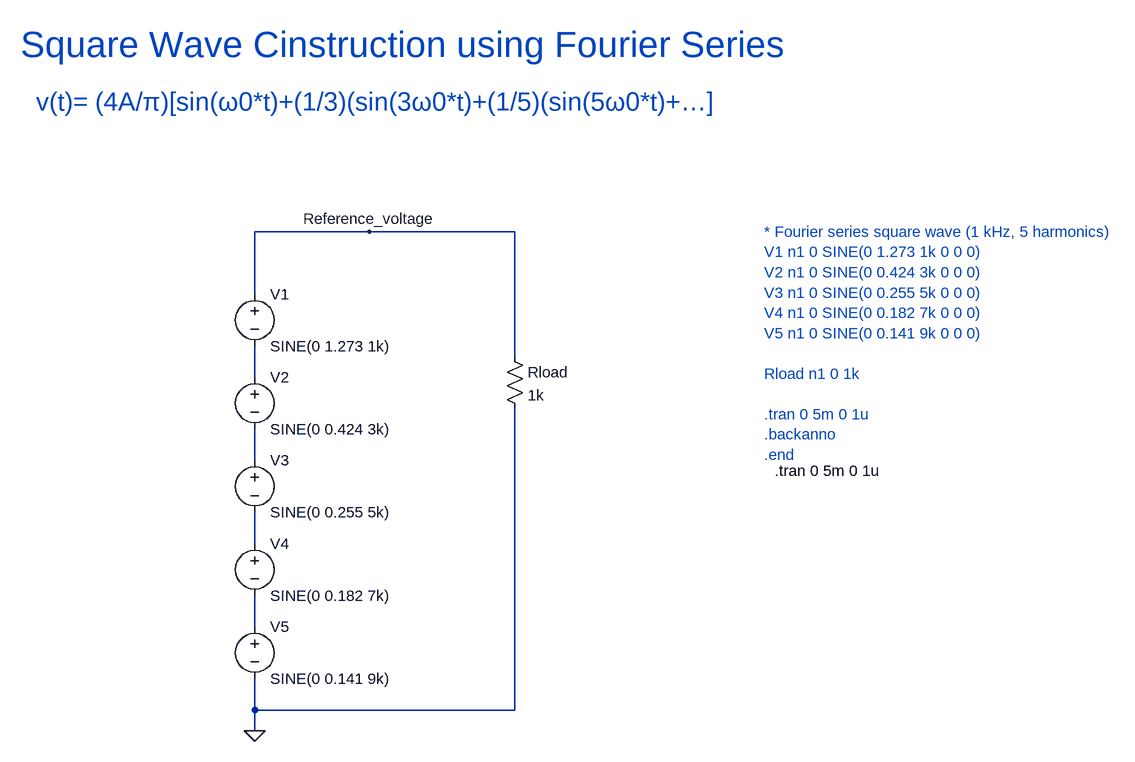
[diagram p0: schematic Sqaure_wave_gen_fourier_series.asc]
Sqaure_wave_gen_fourier_series.asc, the LTspice schematic file:
Version 4
SHEET 1 2504 884
WIRE 864 96 688 96
WIRE 1088 96 864 96
WIRE 688 192 688 96
WIRE 1088 288 1088 96
WIRE 688 320 688 272
WIRE 688 448 688 400
WIRE 688 576 688 528
WIRE 688 704 688 656
WIRE 688 832 688 784
WIRE 1088 832 1088 368
WIRE 1088 832 688 832
WIRE 688 864 688 832
FLAG 688 864 0
FLAG 864 96 Reference_voltage
SYMBOL voltage 688 176 R0
WINDOW 123 0 0 Left 0
WINDOW 39 0 0 Left 0
SYMATTR InstName V1
SYMATTR Value SINE(0 1.273 1k)
SYMBOL voltage 688 304 R0
WINDOW 123 0 0 Left 0
WINDOW 39 0 0 Left 0
SYMATTR InstName V2
SYMATTR Value SINE(0 0.424 3k)
SYMBOL voltage 688 432 R0
WINDOW 123 0 0 Left 0
WINDOW 39 0 0 Left 0
SYMATTR InstName V3
SYMATTR Value SINE(0 0.255 5k)
SYMBOL voltage 688 560 R0
WINDOW 123 0 0 Left 0
WINDOW 39 0 0 Left 0
SYMATTR InstName V4
SYMATTR Value SINE(0 0.182 7k)
SYMBOL voltage 688 688 R0
WINDOW 123 0 0 Left 0
WINDOW 39 0 0 Left 0
SYMATTR InstName V5
SYMATTR Value SINE(0 0.141 9k)
SYMBOL res 1072 272 R0
SYMATTR InstName Rload
SYMATTR Value 1k
TEXT 1472 96 Left 2 ;* Fourier series square wave (1 kHz, 5 harmonics)\nV1 n1 0 SINE(0 1.273 1k 0 0 0)\nV2 n1 0 SINE(0 0.424 3k 0 0 0)\nV3 n1 0 SINE(0 0.255 5k 0 0 0)\nV4 n1 0 SINE(0 0.182 7k 0 0 0)\nV5 n1 0 SINE(0 0.141 9k 0 0 0)\n \nRload n1 0 1k\n \n.tran 0 5m 0 1u\n.backanno\n.end
TEXT 1488 464 Left 2 !.tran 0 5m 0 1u
TEXT 352 -104 Left 4 ;v(t)= (4A/π)[sin(ω0*t)+(1/3)(sin(3ω0*t)+(1/5)(sin(5ω0*t)+…]
TEXT 328 -192 Left 5 ;Square Wave Cinstruction using Fourier Series

The netlist it stands for:
* Sqaure_wave_gen_fourier_series.asc
V1 Reference_voltage N001 SINE(0 1.273 1k)
V2 N001 N002 SINE(0 0.424 3k)
V3 N002 N003 SINE(0 0.255 5k)
V4 N003 N004 SINE(0 0.182 7k)
V5 N004 0 SINE(0 0.141 9k)
Rload Reference_voltage 0 1k
* * Fourier series square wave (1 kHz, 5 harmonics)
* V1 n1 0 SINE(0 1.273 1k 0 0 0)
* V2 n1 0 SINE(0 0.424 3k 0 0 0)
* V3 n1 0 SINE(0 0.255 5k 0 0 0)
* V4 n1 0 SINE(0 0.182 7k 0 0 0)
* V5 n1 0 SINE(0 0.141 9k 0 0 0)
* Rload n1 0 1k
* .tran 0 5m 0 1u
* .backanno
* .end
.tran 0 5m 0 1u
* v(t)= (4A/π)[sin(ω0*t)+(1/3)(sin(3ω0*t)+(1/5)(sin(5ω0*t)+…]
* Square Wave Cinstruction using Fourier Series
.backanno
.end